# EAGLE design kit (EAGLE 9.0.1)

## Sheet 1 of 6
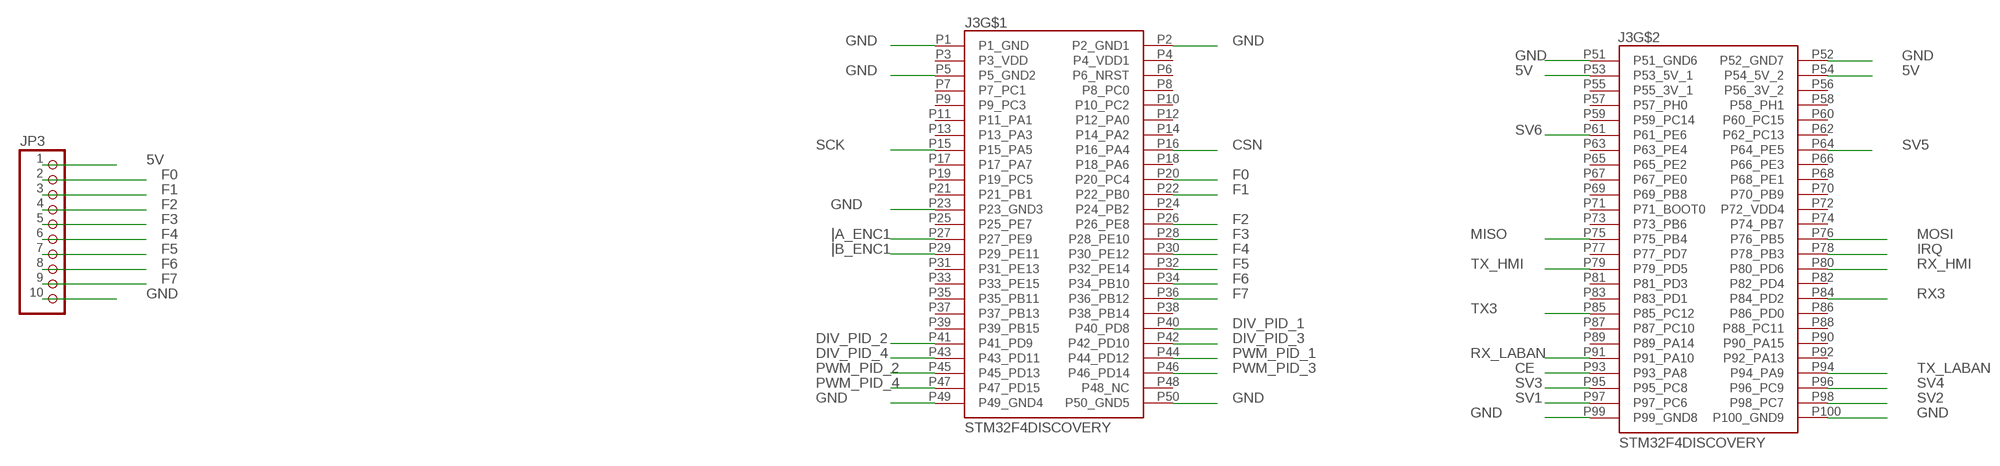
[diagram p0: schematic, sheet 1]

### Parts
J3  STM32F4DISCOVERY  [STMICROELECTRONICS_STM32F4DISCOVERY]
JP3  PINHD-1X10/90  [1X10/90]

### Nets
5V: J3.P53(P53_5V_1) J3.P54(P54_5V_2) JP3.1 ; also sheet 2,3,4,5,6
CE: J3.P93(P93_PA8) ; also sheet 5
CSN: J3.P16(P16_PA4) ; also sheet 5
DIV_PID_1: J3.P40(P40_PD8) ; also sheet 2
DIV_PID_2: J3.P41(P41_PD9) ; also sheet 2
DIV_PID_3: J3.P42(P42_PD10) ; also sheet 2
DIV_PID_4: J3.P43(P43_PD11) ; also sheet 2
F0: J3.P20(P20_PC4) JP3.2
F1: J3.P22(P22_PB0) JP3.3
F2: J3.P26(P26_PE8) JP3.4
F3: J3.P28(P28_PE10) JP3.5
F4: J3.P30(P30_PE12) JP3.6
F5: J3.P32(P32_PE14) JP3.7
F6: J3.P34(P34_PB10) JP3.8
F7: J3.P36(P36_PB12) JP3.9
GND: J3.P1(P1_GND) J3.P2(P2_GND1) J3.P5(P5_GND2) J3.P23(P23_GND3) J3.P49(P49_GND4) J3.P50(P50_GND5) J3.P51(P51_GND6) J3.P52(P52_GND7) J3.P99(P99_GND8) J3.P100(P100_GND9) JP3.10 ; also sheet 2,3,4,5,6
IRQ: J3.P78(P78_PB3) ; also sheet 5
MISO: J3.P75(P75_PB4) ; also sheet 5
MOSI: J3.P76(P76_PB5) ; also sheet 5
PWM_PID_1: J3.P44(P44_PD12) ; also sheet 2
PWM_PID_2: J3.P45(P45_PD13) ; also sheet 2
PWM_PID_3: J3.P46(P46_PD14) ; also sheet 2
PWM_PID_4: J3.P47(P47_PD15) ; also sheet 2
RX3: J3.P84(P84_PD2) ; also sheet 5
RX_HMI: J3.P80(P80_PD6)
RX_LABAN: J3.P91(P91_PA10) ; also sheet 5
SCK: J3.P15(P15_PA5) ; also sheet 5
SV1: J3.P97(P97_PC6) ; also sheet 3
SV2: J3.P98(P98_PC7) ; also sheet 3
SV3: J3.P95(P95_PC8) ; also sheet 3
SV4: J3.P96(P96_PC9) ; also sheet 3
SV5: J3.P64(P64_PE5)
SV6: J3.P61(P61_PE6)
TX3: J3.P85(P85_PC12) ; also sheet 5
TX_HMI: J3.P79(P79_PD5)
TX_LABAN: J3.P94(P94_PA9) ; also sheet 5
|A_ENC1: J3.P27(P27_PE9) ; also sheet 4
|B_ENC1: J3.P29(P29_PE11) ; also sheet 4
Unconnected: J3.P3(P3_VDD) J3.P4(P4_VDD1) J3.P6(P6_NRST) J3.P7(P7_PC1) J3.P8(P8_PC0) J3.P9(P9_PC3) J3.P10(P10_PC2) J3.P11(P11_PA1) J3.P12(P12_PA0) J3.P13(P13_PA3) J3.P14(P14_PA2) J3.P17(P17_PA7) J3.P18(P18_PA6) J3.P19(P19_PC5) J3.P21(P21_PB1) J3.P24(P24_PB2) J3.P25(P25_PE7) J3.P31(P31_PE13) J3.P33(P33_PE15) J3.P35(P35_PB11) J3.P37(P37_PB13) J3.P38(P38_PB14) J3.P39(P39_PB15) J3.P48(P48_NC) J3.P55(P55_3V_1) J3.P56(P56_3V_2) J3.P57(P57_PH0) J3.P58(P58_PH1) J3.P59(P59_PC14) J3.P60(P60_PC15) J3.P62(P62_PC13) J3.P63(P63_PE4) J3.P65(P65_PE2) J3.P66(P66_PE3) J3.P67(P67_PE0) J3.P68(P68_PE1) J3.P69(P69_PB8) J3.P70(P70_PB9) J3.P71(P71_BOOT0) J3.P72(P72_VDD4) J3.P73(P73_PB6) J3.P74(P74_PB7) J3.P77(P77_PD7) J3.P81(P81_PD3) J3.P82(P82_PD4) J3.P83(P83_PD1) J3.P86(P86_PD0) J3.P87(P87_PC10) J3.P88(P88_PC11) J3.P89(P89_PA14) J3.P90(P90_PA15) J3.P92(P92_PA13)

## Sheet 2 of 6
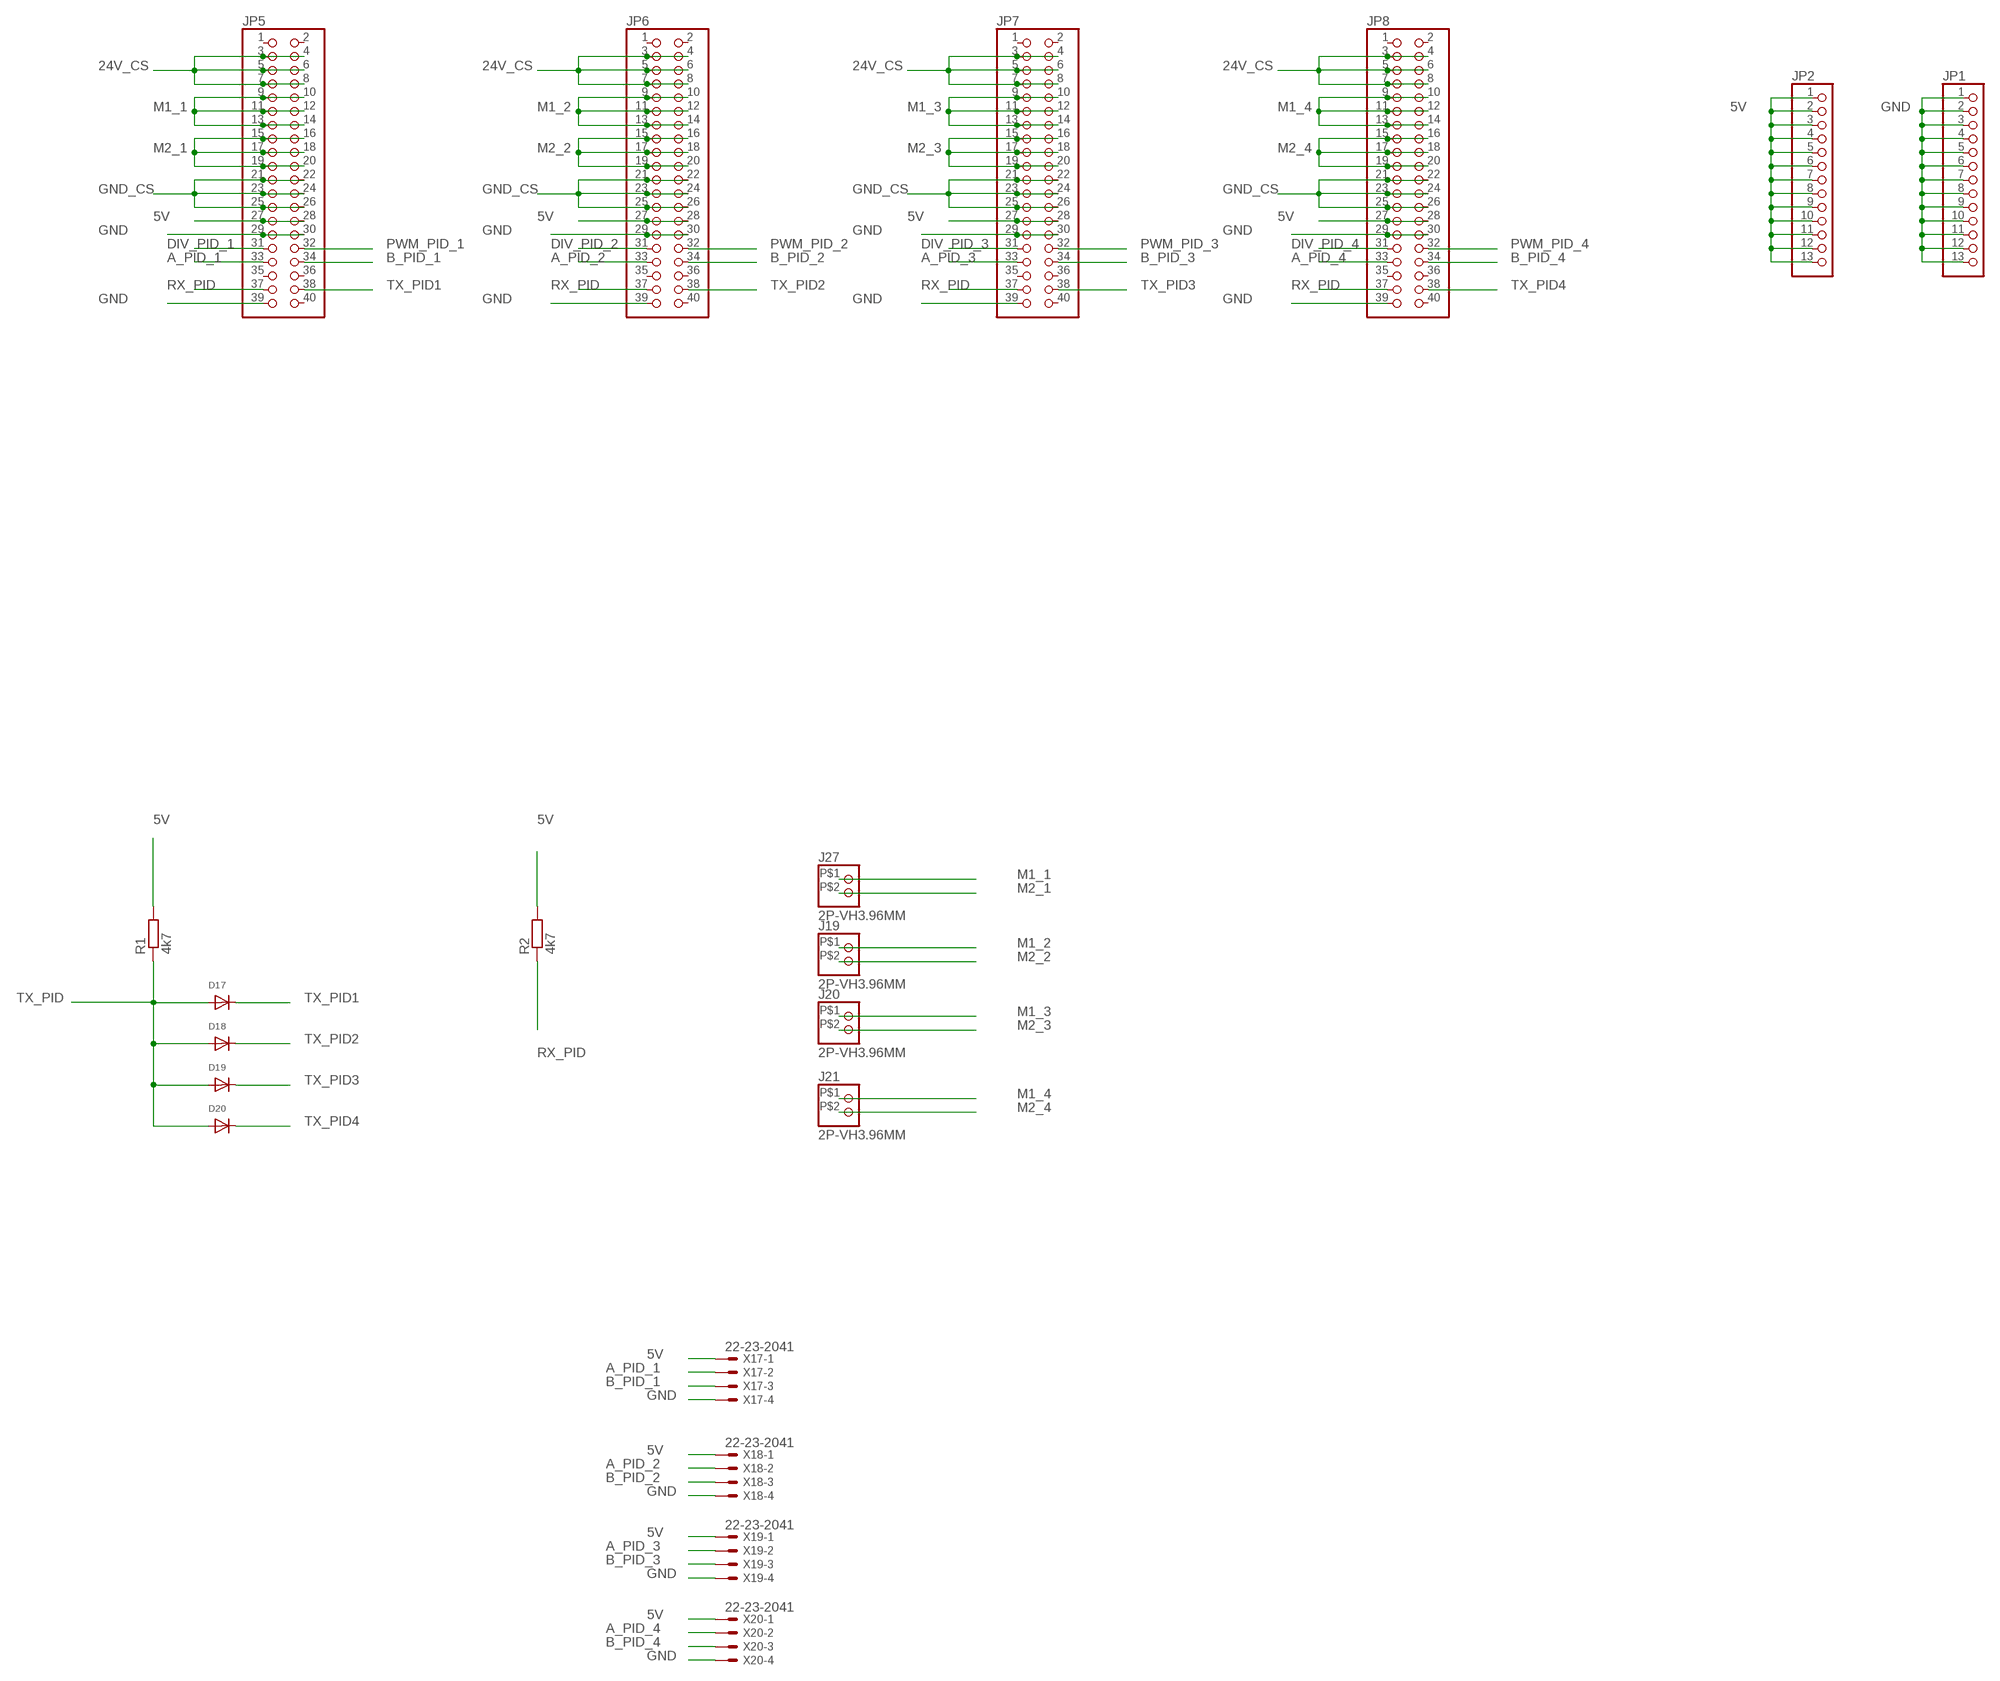
[diagram p1: schematic, sheet 2]

### Parts
D17  DIODEDO-1N4148  [DO-1N4148]
D18  DIODEDO-1N4148  [DO-1N4148]
D19  DIODEDO-1N4148  [DO-1N4148]
D20  DIODEDO-1N4148  [DO-1N4148]
J19  2P-VH3.96MM  [2P-VH3.96MM]
J20  2P-VH3.96MM  [2P-VH3.96MM]
J21  2P-VH3.96MM  [2P-VH3.96MM]
J27  2P-VH3.96MM  [2P-VH3.96MM]
JP1  PINHD-1X13  [1X13]
JP2  PINHD-1X13  [1X13]
JP5  PINHD-2X20  [2X20]
JP6  PINHD-2X20  [2X20]
JP7  PINHD-2X20  [2X20]
JP8  PINHD-2X20  [2X20]
R1  4k7  R-EU_0207/10  [0207/10]
R2  4k7  R-EU_0207/10  [0207/10]
X17  22-23-2041  [22-23-2041]
X18  22-23-2041  [22-23-2041]
X19  22-23-2041  [22-23-2041]
X20  22-23-2041  [22-23-2041]

### Nets
5V: JP2.1 JP2.2 JP2.3 JP2.4 JP2.5 JP2.6 JP2.7 JP2.8 JP2.9 JP2.10 JP2.11 JP2.12 JP2.13 JP5.27 JP5.28 JP6.27 JP6.28 JP7.27 JP7.28 JP8.27 JP8.28 R1.2 R2.2 X17.1 X18.1 X19.1 X20.1 ; also sheet 1,3,4,5,6
24V_CS: JP5.3 JP5.4 JP5.5 JP5.6 JP5.7 JP5.8 JP6.3 JP6.4 JP6.5 JP6.6 JP6.7 JP6.8 JP7.3 JP7.4 JP7.5 JP7.6 JP7.7 JP7.8 JP8.3 JP8.4 JP8.5 JP8.6 JP8.7 JP8.8 ; also sheet 6
A_PID_1: JP5.33 X17.2
A_PID_2: JP6.33 X18.2
A_PID_3: JP7.33 X19.2
A_PID_4: JP8.33 X20.2
B_PID_1: JP5.34 X17.3
B_PID_2: JP6.34 X18.3
B_PID_3: JP7.34 X19.3
B_PID_4: JP8.34 X20.3
DIV_PID_1: JP5.31 ; also sheet 1
DIV_PID_2: JP6.31 ; also sheet 1
DIV_PID_3: JP7.31 ; also sheet 1
DIV_PID_4: JP8.31 ; also sheet 1
GND: JP1.1 JP1.2 JP1.3 JP1.4 JP1.5 JP1.6 JP1.7 JP1.8 JP1.9 JP1.10 JP1.11 JP1.12 JP1.13 JP5.29 JP5.30 JP5.39 JP6.29 JP6.30 JP6.39 JP7.29 JP7.30 JP7.39 JP8.29 JP8.30 JP8.39 X17.4 X18.4 X19.4 X20.4 ; also sheet 1,3,4,5,6
GND_CS: JP5.21 JP5.22 JP5.23 JP5.24 JP5.25 JP5.26 JP6.21 JP6.22 JP6.23 JP6.24 JP6.25 JP6.26 JP7.21 JP7.22 JP7.23 JP7.24 JP7.25 JP7.26 JP8.21 JP8.22 JP8.23 JP8.24 JP8.25 JP8.26 ; also sheet 6
M1_1: J27.P$1 JP5.9 JP5.10 JP5.11 JP5.12 JP5.13 JP5.14
M1_2: J19.P$1 JP6.9 JP6.10 JP6.11 JP6.12 JP6.13 JP6.14
M1_3: J20.P$1 JP7.9 JP7.10 JP7.11 JP7.12 JP7.13 JP7.14
M1_4: J21.P$1 JP8.9 JP8.10 JP8.11 JP8.12 JP8.13 JP8.14
M2_1: J27.P$2 JP5.15 JP5.16 JP5.17 JP5.18 JP5.19 JP5.20
M2_2: J19.P$2 JP6.15 JP6.16 JP6.17 JP6.18 JP6.19 JP6.20
M2_3: J20.P$2 JP7.15 JP7.16 JP7.17 JP7.18 JP7.19 JP7.20
M2_4: J21.P$2 JP8.15 JP8.16 JP8.17 JP8.18 JP8.19 JP8.20
PWM_PID_1: JP5.32 ; also sheet 1
PWM_PID_2: JP6.32 ; also sheet 1
PWM_PID_3: JP7.32 ; also sheet 1
PWM_PID_4: JP8.32 ; also sheet 1
RX_PID: JP5.37 JP6.37 JP7.37 JP8.37 R2.1 ; also sheet 5
TX_PID: D17.A D18.A D19.A D20.A R1.1 ; also sheet 5
TX_PID1: D17.C JP5.38
TX_PID2: D18.C JP6.38
TX_PID3: D19.C JP7.38
TX_PID4: D20.C JP8.38
Unconnected: JP5.1 JP5.2 JP5.35 JP5.36 JP5.40 JP6.1 JP6.2 JP6.35 JP6.36 JP6.40 JP7.1 JP7.2 JP7.35 JP7.36 JP7.40 JP8.1 JP8.2 JP8.35 JP8.36 JP8.40

## Sheet 3 of 6
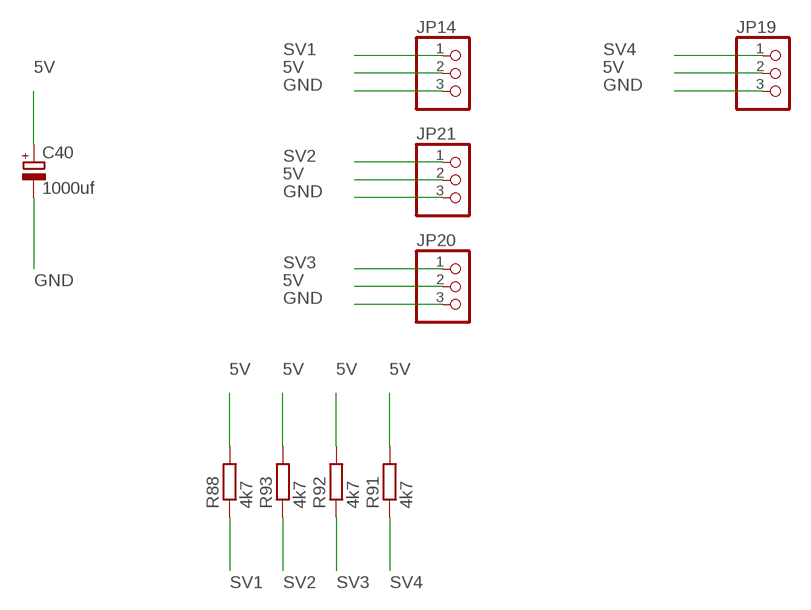
[diagram p2: schematic, sheet 3]

### Parts
C40  1000uf  CPOL-EUE5-10.5  [E5-10,5]
JP14  PINHD-1X3  [1X03]
JP19  PINHD-1X3  [1X03]
JP20  PINHD-1X3  [1X03]
JP21  PINHD-1X3  [1X03]
R88  4k7  R-EU_0207/10  [0207/10]
R91  4k7  R-EU_0207/10  [0207/10]
R92  4k7  R-EU_0207/10  [0207/10]
R93  4k7  R-EU_0207/10  [0207/10]

### Nets
5V: C40.+ JP14.2 JP19.2 JP20.2 JP21.2 R88.2 R91.2 R92.2 R93.2 ; also sheet 1,2,4,5,6
GND: C40.- JP14.3 JP19.3 JP20.3 JP21.3 ; also sheet 1,2,4,5,6
SV1: JP14.1 R88.1 ; also sheet 1
SV2: JP21.1 R93.1 ; also sheet 1
SV3: JP20.1 R92.1 ; also sheet 1
SV4: JP19.1 R91.1 ; also sheet 1

## Sheet 4 of 6
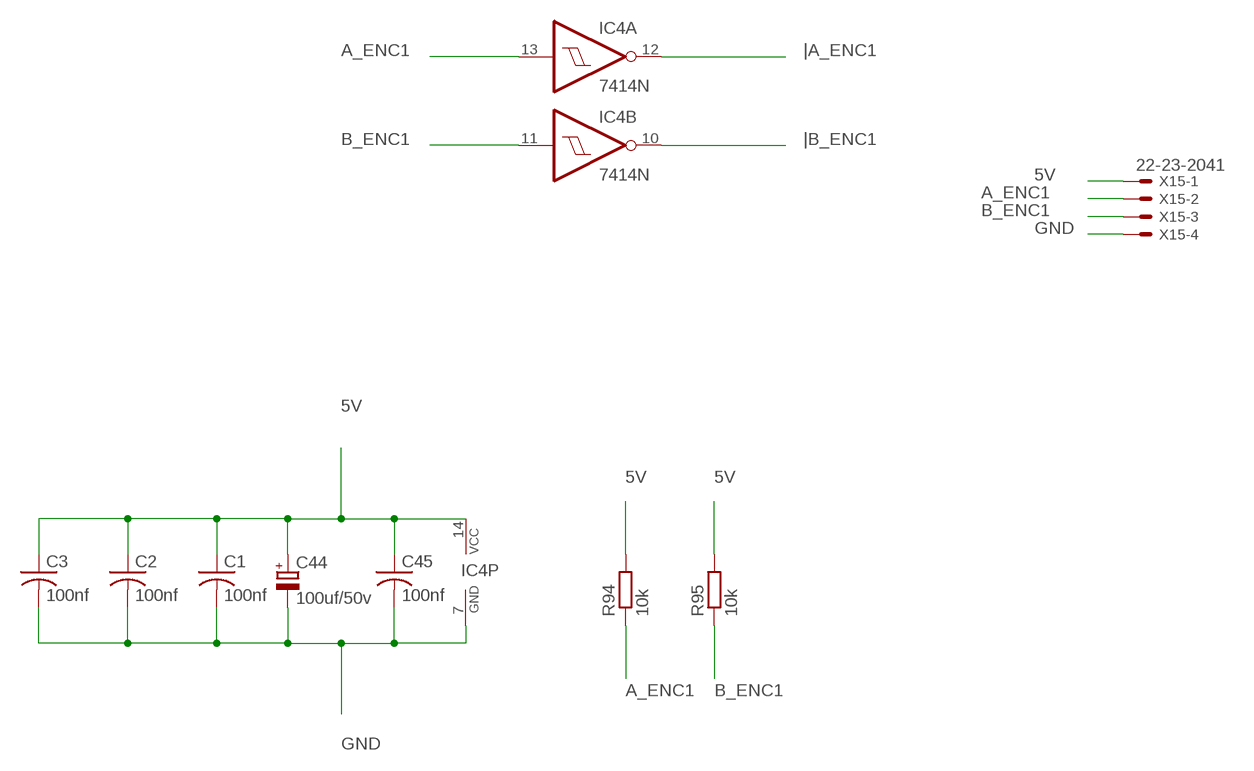
[diagram p3: schematic, sheet 4]

### Parts
C1  100nf  C-US050-025X075  [C050-025X075]
C2  100nf  C-US050-025X075  [C050-025X075]
C3  100nf  C-US050-025X075  [C050-025X075]
C44  100uf/50v  CPOL-EUE5-10.5  [E5-10,5]
C45  100nf  C-US050-025X075  [C050-025X075]
IC4  7414N  [DIL14]
R94  10k  R-EU_0207/10  [0207/10]
R95  10k  R-EU_0207/10  [0207/10]
X15  22-23-2041  [22-23-2041]

### Nets
5V: C1.1 C2.1 C3.1 C44.+ C45.1 IC4.14(P:VCC) R94.2 R95.2 X15.1 ; also sheet 1,2,3,5,6
A_ENC1: IC4.13(A:I) R94.1 X15.2
B_ENC1: IC4.11(B:I) R95.1 X15.3
GND: C1.2 C2.2 C3.2 C44.- C45.2 IC4.7(P:GND) X15.4 ; also sheet 1,2,3,5,6
|A_ENC1: IC4.12(A:O) ; also sheet 1
|B_ENC1: IC4.10(B:O) ; also sheet 1
Unconnected: IC4.1(D:I) IC4.2(D:O) IC4.3(E:I) IC4.4(E:O) IC4.5(F:I) IC4.6(F:O) IC4.8(C:O) IC4.9(C:I)

## Sheet 5 of 6
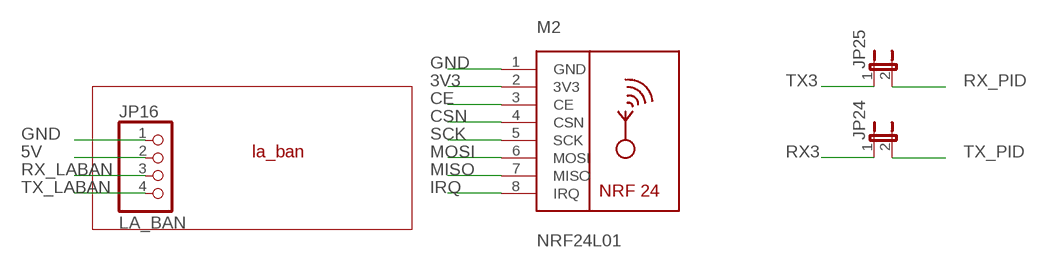
[diagram p4: schematic, sheet 5]

### Parts
JP16  LA_BAN  PINHD-1X4  [1X04]
JP24  JP1E  [JP1]
JP25  JP1E  [JP1]
M2  NRF24L01  [NRF24L01_CHANCAM_ANTEN_ONBOARD]

### Nets
3V3: M2.2(3V3) ; also sheet 6
5V: JP16.2 ; also sheet 1,2,3,4,6
CE: M2.3(CE) ; also sheet 1
CSN: M2.4(CSN) ; also sheet 1
GND: JP16.1 M2.1(GND) ; also sheet 1,2,3,4,6
IRQ: M2.8(IRQ) ; also sheet 1
MISO: M2.7(MISO) ; also sheet 1
MOSI: M2.6(MOSI) ; also sheet 1
RX3: JP24.1 ; also sheet 1
RX_LABAN: JP16.3 ; also sheet 1
RX_PID: JP25.2 ; also sheet 2
SCK: M2.5(SCK) ; also sheet 1
TX3: JP25.1 ; also sheet 1
TX_LABAN: JP16.4 ; also sheet 1
TX_PID: JP24.2 ; also sheet 2

### Notes on the sheet
- la_ban

## Sheet 6 of 6
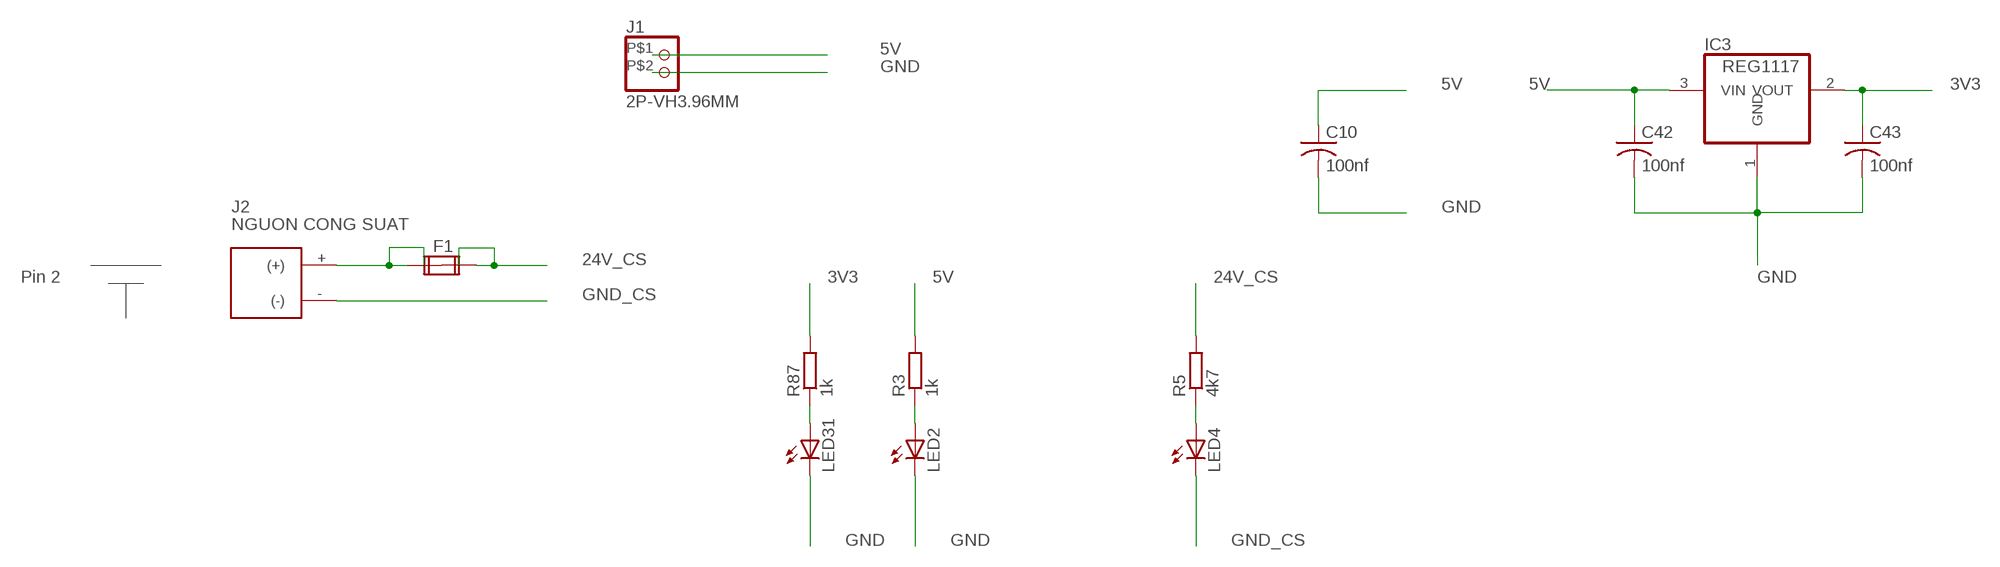
[diagram p5: schematic, sheet 6]

### Parts
C10  100nf  C-US050-025X075  [C050-025X075]
C42  100nf  C-US050-025X075  [C050-025X075]
C43  100nf  C-US050-025X075  [C050-025X075]
F1  FUSE2P  [FUSE1]
IC3  REG1117  [SOT223]
J1  2P-VH3.96MM  [2P-VH3.96MM]
J2  NGUON CONG SUAT  JACK-DC  [XT-60]
LED2  LED3MM  [LED3MM]
LED4  LED3MM  [LED3MM]
LED31  LED3MM  [LED3MM]
R3  1k  R-EU_0207/10  [0207/10]
R5  4k7  R-EU_0207/10  [0207/10]
R87  1k  R-EU_0207/10  [0207/10]

### Nets
3V3: C43.1 IC3.2(VOUT) R87.2 ; also sheet 5
5V: C10.1 C42.1 IC3.3(VIN) J1.P$1 R3.2 ; also sheet 1,2,3,4,5
24V_CS: F1.2A F1.2B R5.2 ; also sheet 2
GND: C10.2 C42.2 C43.2 IC3.1(GND) J1.P$2 LED2.K(C) LED31.K(C) ; also sheet 1,2,3,4,5
GND_CS: J2.-((-)) LED4.K(C) ; also sheet 2
N$5: LED2.A R3.1
N$7: LED4.A R5.1
N$124: F1.1A F1.1B J2.+((+))
N$127: LED31.A R87.1

### Notes on the sheet
- Pin 2

## Library data of the parts
C1-C3 C10 C42 C43 C45 = adafruit:C-US: CAPACITOR, American symbol
C40 C44 = rcl:CPOL-EU: POLARIZED CAPACITOR, European symbol; SPICEPREFIX: C
D17-D20 = adafruit:DIODE: Diode SMADIODE - SMA Surface Mount Package 20V 1A Schottky Diode Digikey: 641-1014-6-ND DO-1N4148 - Through Hole Small Current Diode SOD-123 20V 1 A (.5mV Vf) Schottky Diode - Digikey: MBRX120TPMSCT-ND SOD-323 10V 570mA (.38mV Vf, 3ns) Schottky Diode - Digikey: ZLLS410CT-ND SOD-523 30V 30mA Schottky Diode (RB751S-40TE61) - Digikey: RB751S-40TE61CT-ND SOT23-R/W - SOT23 Package (R = Solder Paste/Reflow Ovens, W = Hand-Soldering) BAT54Film 40V 300mA - Digikey: 497-7162-1-ND
F1 = special:FUSE2P: FUSE 5 x 20 mm
IC3 = burr-brown:REG1117: 800mA and 1A Low Dropout (LDO) Positive Regulator 1.8V, 2.5V, 2.85V, 3.3V, 5V, and Adj; MPN: REG1117; OC_FARNELL: 1097566; OC_NEWARK: 14P6981
IC4 = 74xx-eu:74*14: Hex schmitt trigger INVERTER
J1 J19-J21 J27 = minh:2P-VH3.96MM
J2 = minh:JACK-DC
J3 = STM32F4DISCOVERY:STM32F4DISCOVERY: EVAL KIT STM32F DISCOVERY; AVAILABILITY: Unavailable; DESCRIPTION: Development kit: ARM ST; pin strips, pin header; No.of; MF: STMicroelectronics; MP: STM32F4DISCOVERY; PACKAGE: None; PRICE: None
JP1 JP2 = pinhead:PINHD-1X13: PIN HEADER
JP3 = pinhead:PINHD-1X10: PIN HEADER
JP5-JP8 = minh:PINHD-2X20: PIN HEADER
JP14 JP19-JP21 = pinhead:PINHD-1X3: PIN HEADER
JP16 = pinhead:PINHD-1X4: PIN HEADER
JP24 JP25 = jumper:JP1E: JUMPER
LED2 LED4 LED31 = adafruit:LED: LED OSRAM: - CHIPLED LG R971, LG N971, LY N971, LG Q971, LY Q971, LO R971, LY R971 LH N974, LH R974 LS Q976, LO Q976, LY Q976 LO Q996 - Hyper CHIPLED LW Q18S LB Q993, LB Q99A, LB R99A - SideLED LS A670, LO A670, LY A670, LG A670, LP A670 LB A673, LV A673, LT A673, LW A673 LH A674 LY A675 LS A676, LA A676, LO A676, LY A676, LW A676 LS A679, LY A679, LG A679 - Hyper Micro SIDELED® LS Y876, LA Y876, LO Y876, LY Y876 LT Y87S - SmartLED LW L88C, LW L88S LB L89C, LB L89S, LG L890 LS L89K, LO L89K, LY L89K LS L896, LA L896, LO L896, LY L896 - TOPLED LS T670, LO T670, LY T670, LG T670, LP T670 LSG T670, LSP T670, LSY T670, LOP T670, LYG T670 LG T671, LOG T671, LSG T671 LB T673, LV T673, LT T673, LW T673 LH T674 LS T676, LA T676, LO T676, LY T676, LB T676, LH T676, LSB T676, LW T676 LB T67C, LV T67C, LT T67C, LS T67K, LO T67K, LY T67K, LW E67C LS E67B, LA E67B, LO E67B, LY E67B, LB E67C, LV E67C, LT E67C LW T67C LS T679, LY T679, LG T679 LS T770, LO T770, LY T770, LG T770, LP T770 LB T773, LV T773, LT T773, LW T773 LH T774 LS E675, LA E675, LY E675, LS T675 LS T776, LA T776, LO T776, LY T776, LB T776 LHGB T686 LT T68C, LB T68C - Hyper Mini TOPLED® LB M676 - Mini TOPLED Santana® LG M470 LS M47K, LO M47K, LY M47K Source: http://www.osram.convergy.de/
M2 = minh:NRF24L01
R1-R3 R5 R87 R88 R91-R95 = rcl:R-EU_: RESISTOR, European symbol; SPICEPREFIX: R
X15 X17-X20 = con-molex:22-23-2041: .100" (2.54mm) Center Header - 4 Pin; MF: MOLEX; MPN: 22-23-2041; OC_FARNELL: 1462920; OC_NEWARK: 38C0355

## Board
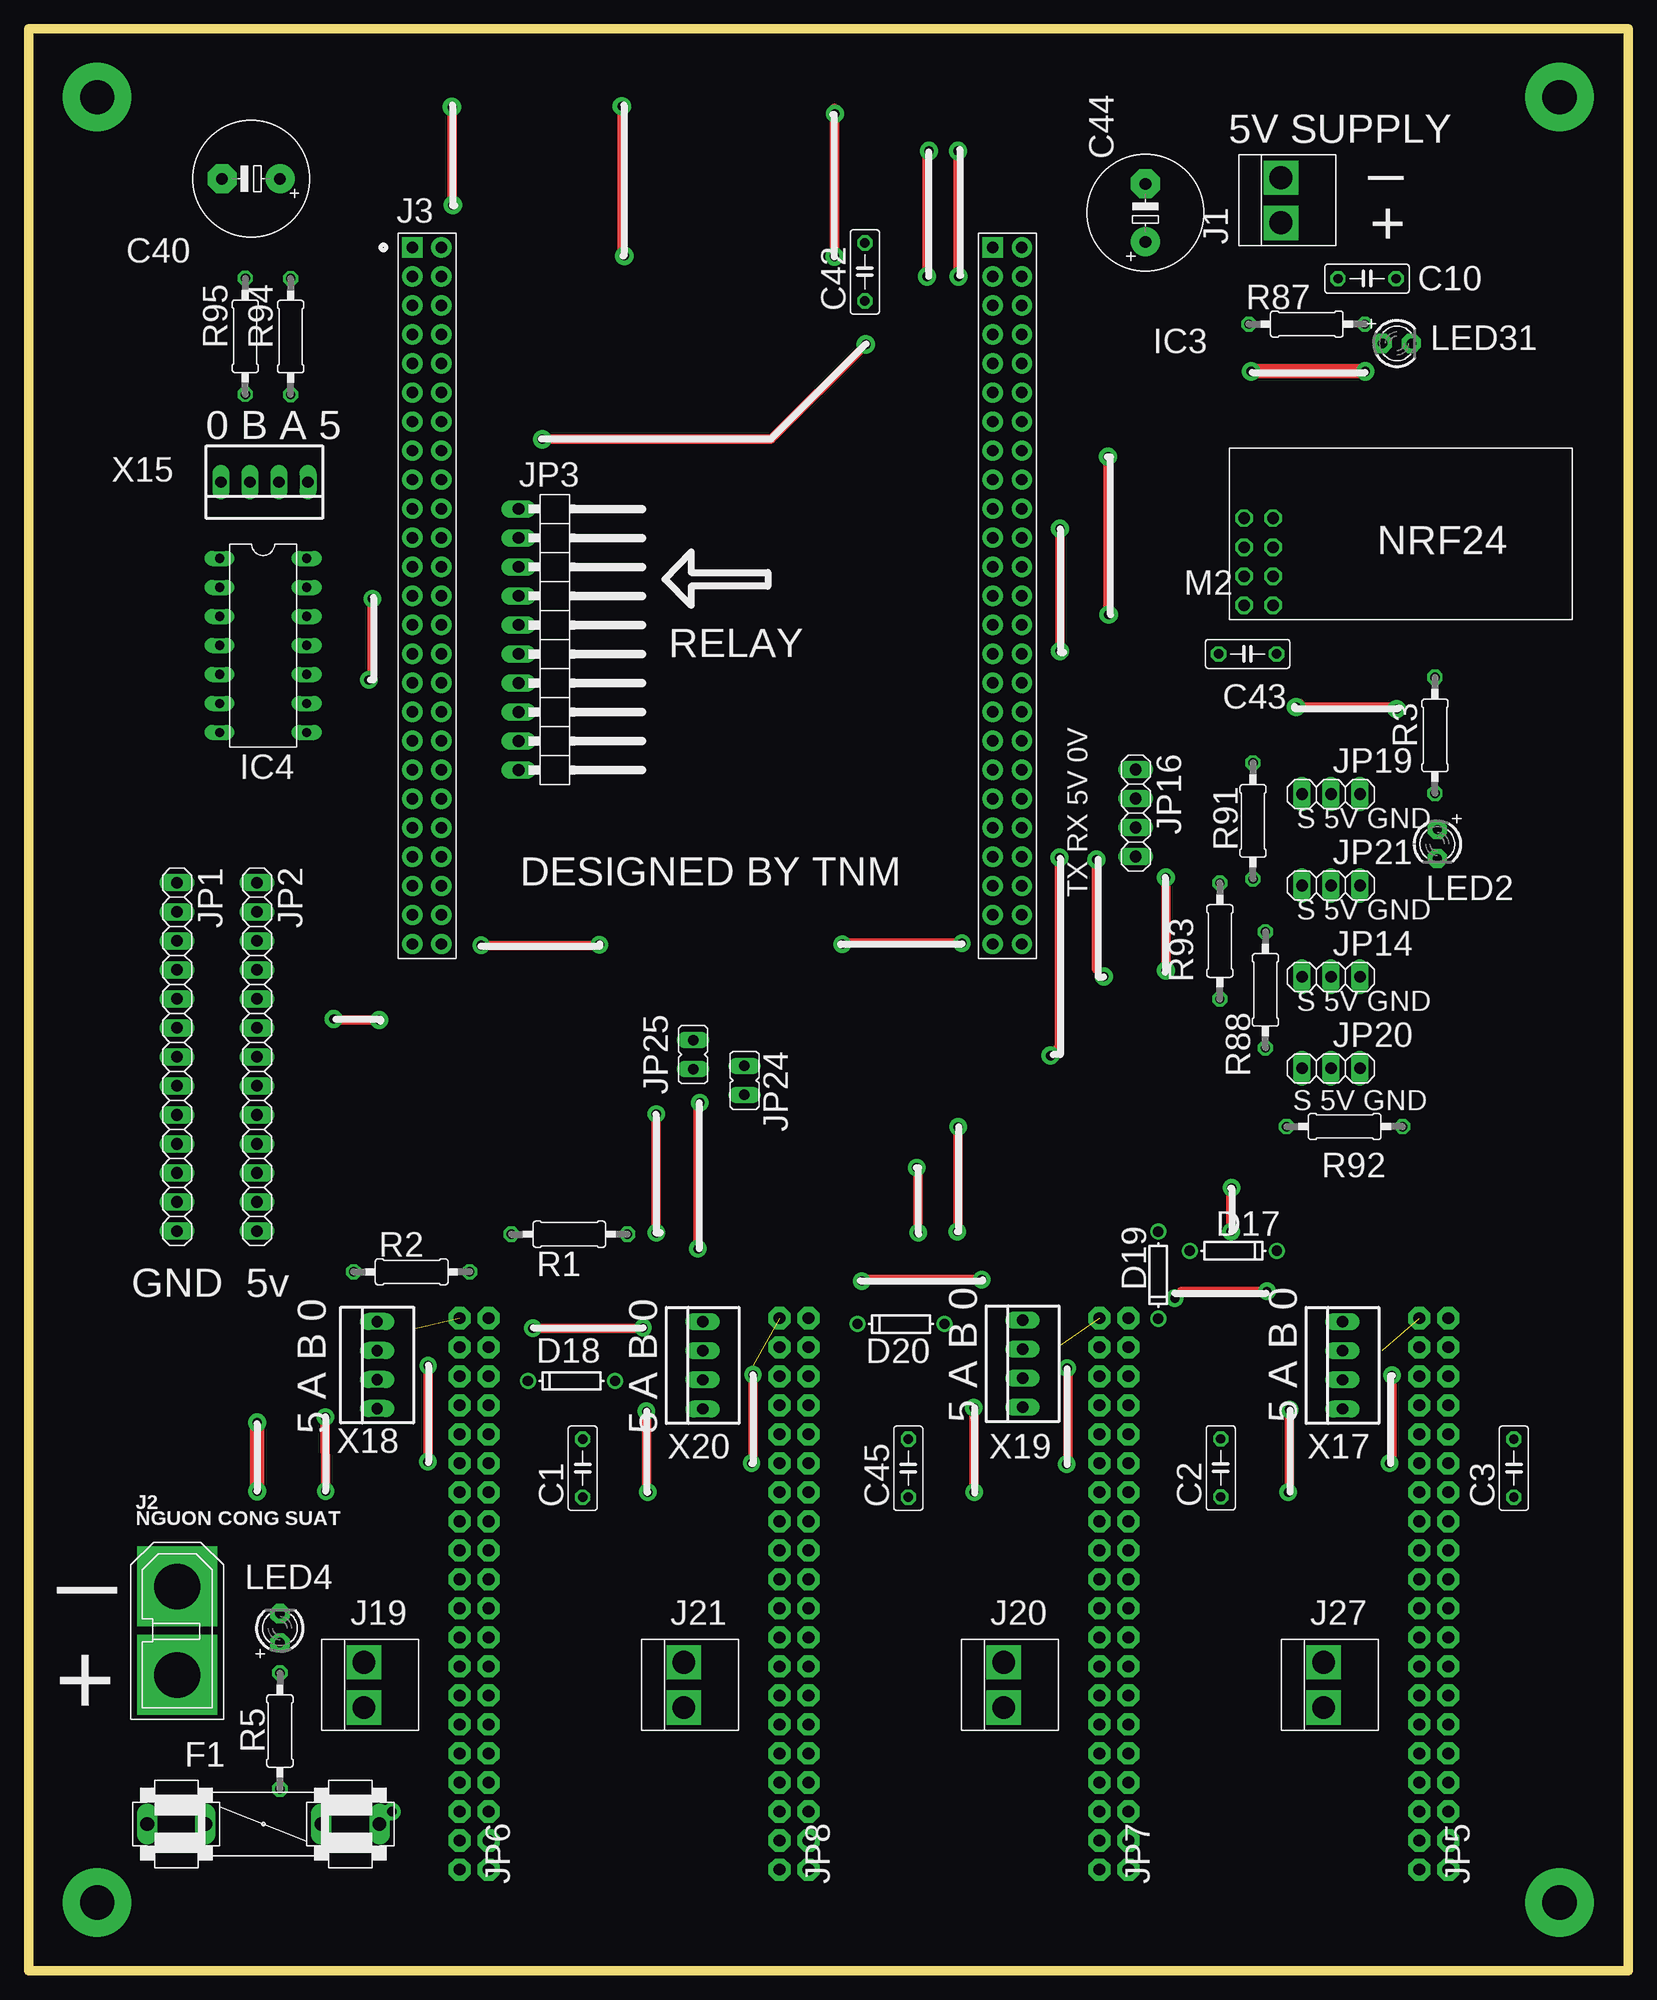
[diagram p6: board, top side]
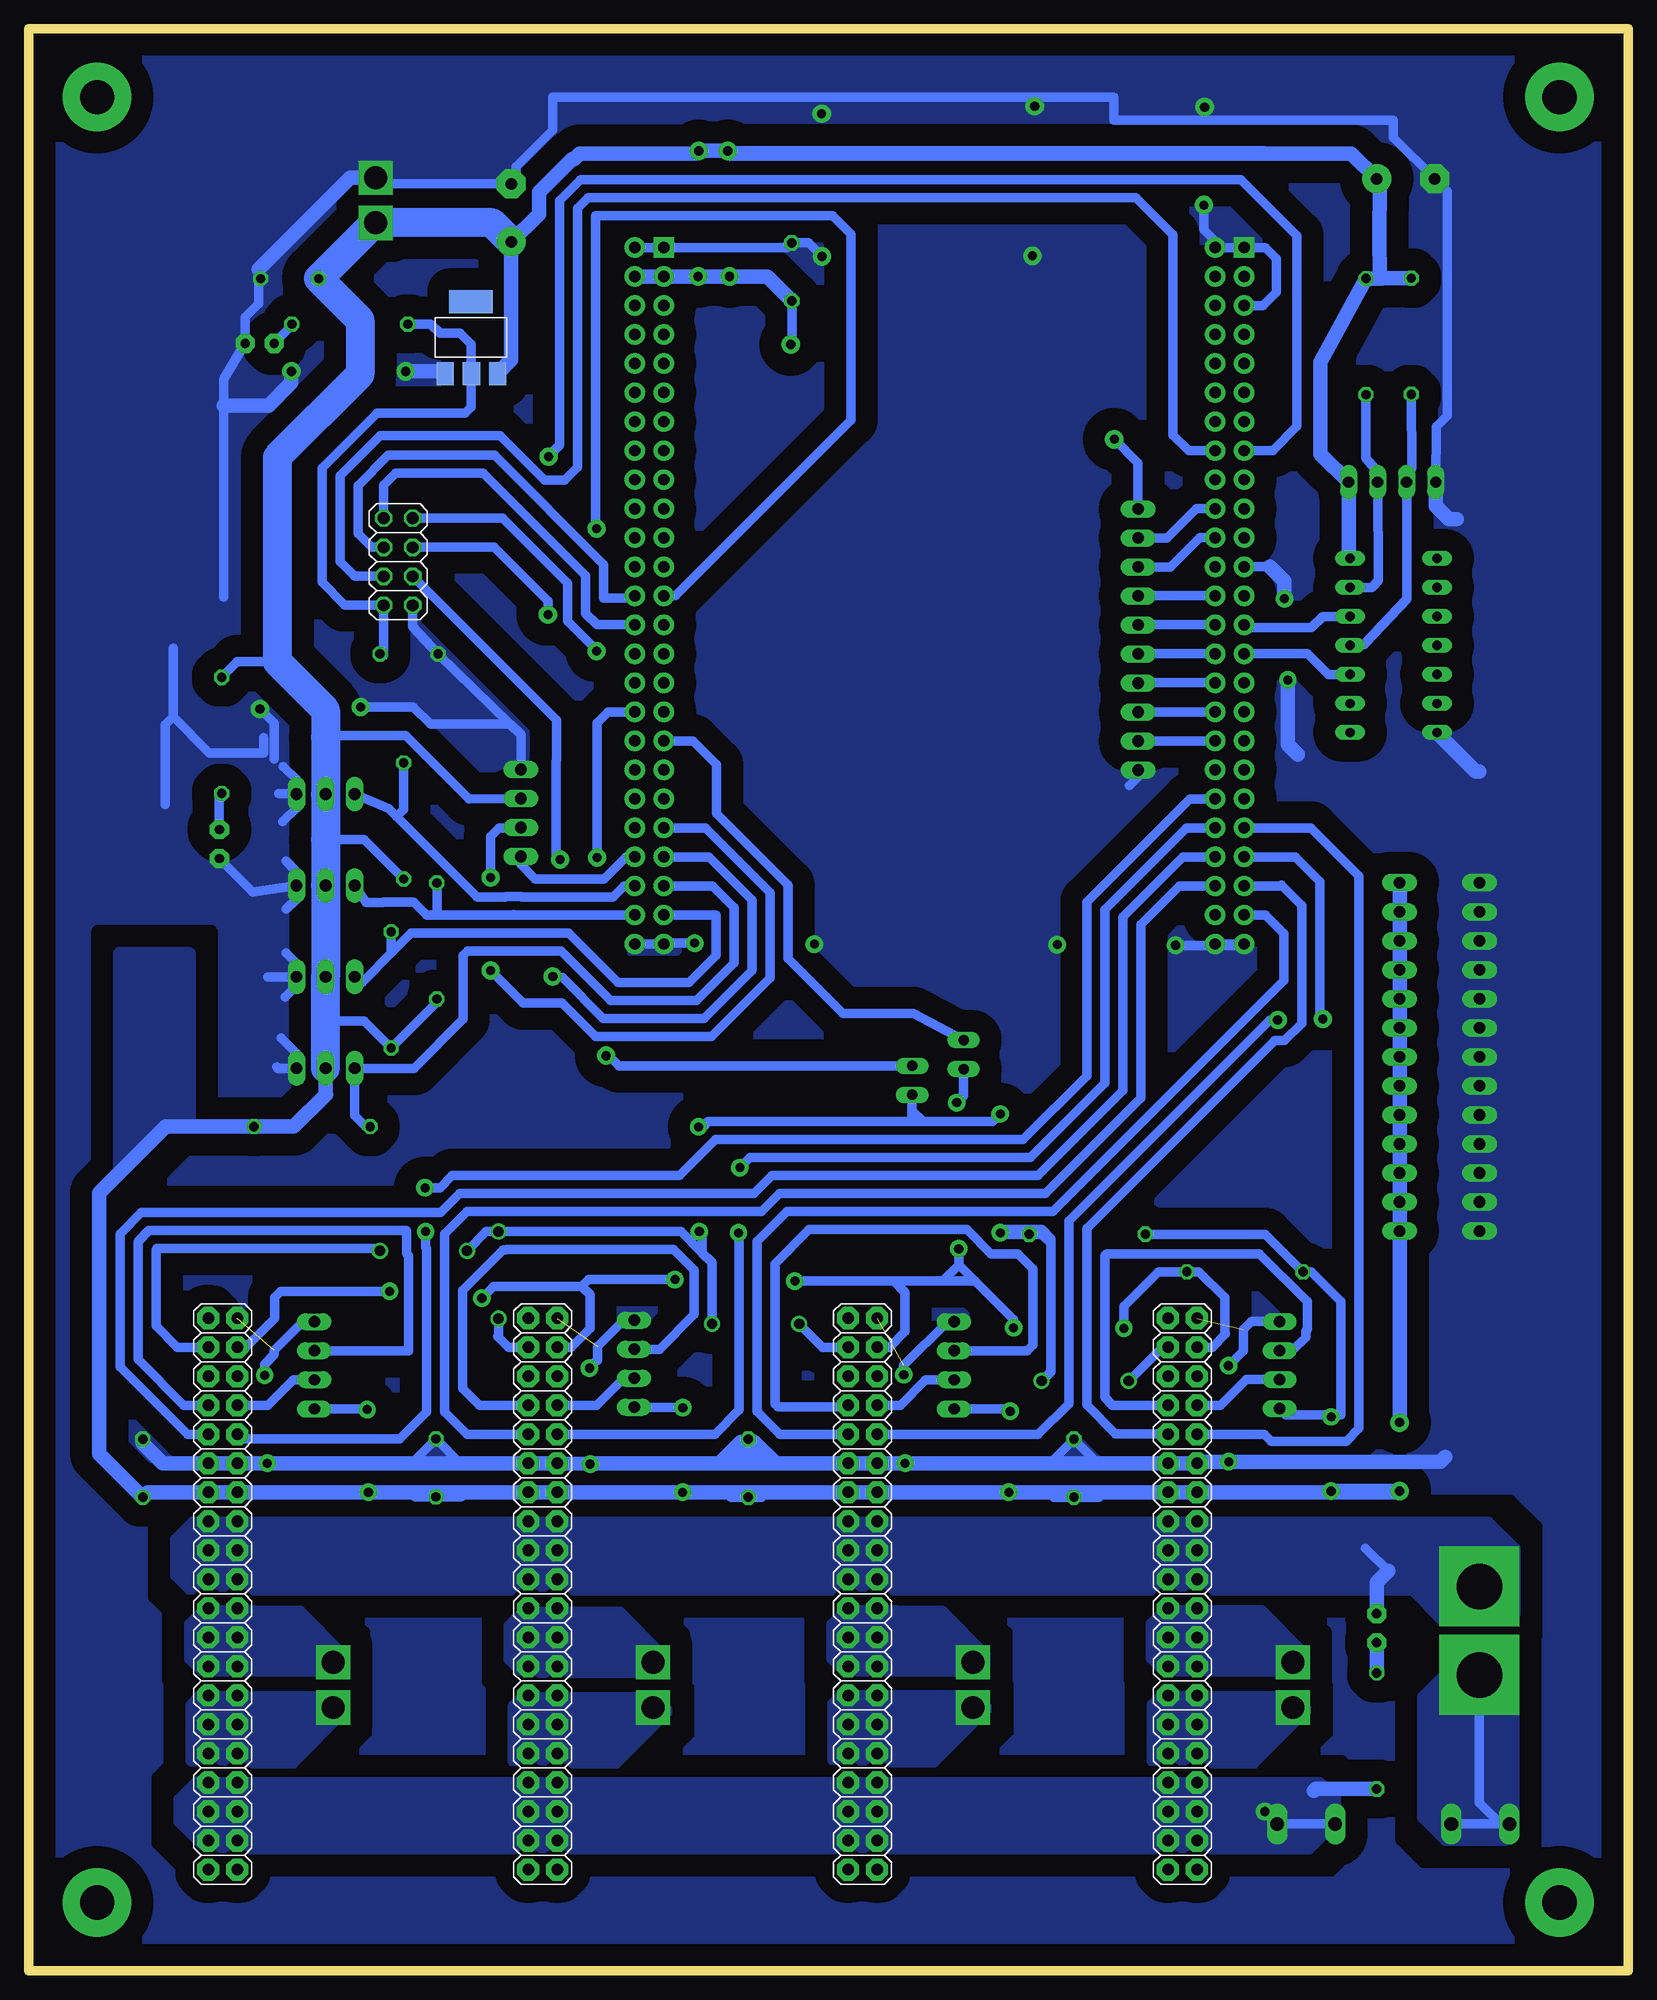
[diagram p7: board, bottom side, seen from below]

Size 140 x 170 mm. Coordinates in mm from the lower left corner, seen from the top.
Outline: 0,0 0,170 140,170 140,0 0,0
Copper layers (1*16): Top 0.035mm / dielectric 1.5mm / Bottom 0.035mm
Design rules "default *": minimum track width 30mil, minimum drill 0.8mm, track to track 30mil, track to pad 20mil, pad to pad 20mil, via to via 20mil, smd to smd 6mil, copper to edge 40mil, drill to drill 6mil, minimum pad ring 10mil, minimum via ring 8mil, stop-mask expansion 4mil, vias tented up to drill 0mil, thermal gap 10mil

### Footprints (pad centres in the part's own frame; a part is rotated, then mirrored left to right if it is on the bottom)
C050-025X075 = drill 0.813 octagon: 1 -2.54,0; 2 2.54,0
E5-10,5 = drill 1.016 pad 2.54: + -2.54,0 | drill 1.016 pad 2.54 octagon: - 2.54,0
DO-1N4148 = drill 0.9: A -3.81,0; C 3.81,0
FUSE1 = drill 1.194 long: 1A -10.16,0; 1B -5.08,0; 2A 10.16,0; 2B 5.08,0
SOT223 = smd 1.499 x 2.007: 1 -2.261,-3.15; 2 0.025,-3.15; 3 2.311,-3.15 | smd 3.81 x 2.007: 4 0,3.15
DIL14 = drill 0.813 long: 1 -7.62,-3.81; 2 -5.08,-3.81; 3 -2.54,-3.81; 4 0,-3.81; 5 2.54,-3.81; 6 5.08,-3.81; 7 7.62,-3.81; 8 7.62,3.81; 9 5.08,3.81; 10 2.54,3.81; 11 0,3.81; 12 -2.54,3.81; 13 -5.08,3.81; 14 -7.62,3.81
2P-VH3.96MM = drill 2 square: P$1 -1.956,1.651; P$2 2.004,1.651
XT-60 = drill 4 pad 7 square: + 0.24,-3.745; - 0.24,4.005
STMICROELECTRONICS_STM32F4DISCOVERY = drill 1 pad 1.778 square: P1 0,0; P51 50.8,0 | drill 1 pad 1.778: P2 2.54,0; P3 0,-2.54; P4 2.54,-2.54; P5 0,-5.08; P6 2.54,-5.08; P7 0,-7.62; P8 2.54,-7.62; P9 0,-10.16; P10 2.54,-10.16; P11 0,-12.7; P12 2.54,-12.7; P13 0,-15.24; P14 2.54,-15.24; P15 0,-17.78; P16 2.54,-17.78; P17 0,-20.32; P18 2.54,-20.32; P19 0,-22.86; P20 2.54,-22.86; P21 0,-25.4; P22 2.54,-25.4; P23 0,-27.94; P24 2.54,-27.94; P25 0,-30.48; P26 2.54,-30.48; P27 0,-33.02; P28 2.54,-33.02; P29 0,-35.56; P30 2.54,-35.56; P31 0,-38.1; P32 2.54,-38.1; P33 0,-40.64; P34 2.54,-40.64; P35 0,-43.18; P36 2.54,-43.18; P37 0,-45.72; P38 2.54,-45.72; P39 0,-48.26; P40 2.54,-48.26; P41 0,-50.8; P42 2.54,-50.8; P43 0,-53.34; P44 2.54,-53.34; P45 0,-55.88; P46 2.54,-55.88; P47 0,-58.42; P48 2.54,-58.42; P49 0,-60.96; P50 2.54,-60.96; P52 53.34,0; P53 50.8,-2.54; P54 53.34,-2.54; P55 50.8,-5.08; P56 53.34,-5.08; P57 50.8,-7.62; P58 53.34,-7.62; P59 50.8,-10.16; P60 53.34,-10.16; P61 50.8,-12.7; P62 53.34,-12.7; P63 50.8,-15.24; P64 53.34,-15.24; P65 50.8,-17.78; P66 53.34,-17.78; P67 50.8,-20.32; P68 53.34,-20.32; P69 50.8,-22.86; P70 53.34,-22.86; P71 50.8,-25.4; P72 53.34,-25.4; P73 50.8,-27.94; P74 53.34,-27.94; P75 50.8,-30.48; P76 53.34,-30.48; P77 50.8,-33.02; P78 53.34,-33.02; P79 50.8,-35.56; P80 53.34,-35.56; P81 50.8,-38.1; P82 53.34,-38.1; P83 50.8,-40.64; P84 53.34,-40.64; P85 50.8,-43.18; P86 53.34,-43.18; P87 50.8,-45.72; P88 53.34,-45.72; P89 50.8,-48.26; P90 53.34,-48.26; P91 50.8,-50.8; P92 53.34,-50.8; P93 50.8,-53.34; P94 53.34,-53.34; P95 50.8,-55.88; P96 53.34,-55.88; P97 50.8,-58.42; P98 53.34,-58.42; P99 50.8,-60.96; P100 53.34,-60.96
1X13 = drill 1.016 long: 1 -15.24,0; 2 -12.7,0; 3 -10.16,0; 4 -7.62,0; 5 -5.08,0; 6 -2.54,0; 7 0,0; 8 2.54,0; 9 5.08,0; 10 7.62,0; 11 10.16,0; 12 12.7,0; 13 15.24,0
1X10/90 = drill 1.016 long: 1 -11.43,-3.81; 2 -8.89,-3.81; 3 -6.35,-3.81; 4 -3.81,-3.81; 5 -1.27,-3.81; 6 1.27,-3.81; 7 3.81,-3.81; 8 6.35,-3.81; 9 8.89,-3.81; 10 11.43,-3.81
2X20 = drill 1.016 pad 1.93 octagon: 1 -24.13,-1.27; 2 -24.13,1.27; 3 -21.59,-1.27; 4 -21.59,1.27; 5 -19.05,-1.27; 6 -19.05,1.27; 7 -16.51,-1.27; 8 -16.51,1.27; 9 -13.97,-1.27; 10 -13.97,1.27; 11 -11.43,-1.27; 12 -11.43,1.27; 13 -8.89,-1.27; 14 -8.89,1.27; 15 -6.35,-1.27; 16 -6.35,1.27; 17 -3.81,-1.27; 18 -3.81,1.27; 19 -1.27,-1.27; 20 -1.27,1.27; 21 1.27,-1.27; 22 1.27,1.27; 23 3.81,-1.27; 24 3.81,1.27; 25 6.35,-1.27; 26 6.35,1.27; 27 8.89,-1.27; 28 8.89,1.27; 29 11.43,-1.27; 30 11.43,1.27; 31 13.97,-1.27; 32 13.97,1.27; 33 16.51,-1.27; 34 16.51,1.27; 35 19.05,-1.27; 36 19.05,1.27; 37 21.59,-1.27; 38 21.59,1.27; 39 24.13,-1.27; 40 24.13,1.27
1X03 = drill 1.016 long: 1 -2.54,0; 2 0,0; 3 2.54,0
1X04 = drill 1.016 long: 1 -3.81,0; 2 -1.27,0; 3 1.27,0; 4 3.81,0
JP1 = drill 0.914 long: 1 0,-1.27; 2 0,1.27
LED3MM = drill 0.813 pad 1.676 octagon: A -1.27,0; K 1.27,0
NRF24L01_CHANCAM_ANTEN_ONBOARD = drill 1.016 octagon: 1 1.27,1.27; 2 3.81,1.27; 3 1.27,3.81; 4 3.81,3.81; 5 1.27,6.35; 6 3.81,6.35; 7 1.27,8.89; 8 3.81,8.89
0207/10 = drill 0.813 octagon: 1 -5.08,0; 2 5.08,0
22-23-2041 = drill 1 long: 1 -3.81,0; 2 -1.27,0; 3 1.27,0; 4 3.81,0

### Placement (x,y rotation side)
C1  48.5,44 90 top
C2  104.34,44.03 90 top
C3  130,44 90 top
C10  117.15,148.11 0 top
C40  19.47,156.85 180 top
C42  73.2,148.7 90 top
C43  106.7,115.27 180 top
C44  97.75,153.87 90 top
C45  77,44 90 top
D17  105.44,63.03 0 top
D18  47.52,51.64 180 top
D19  98.87,60.9 270 top
D20  76.36,56.62 180 top
F1  20.55,12.86 0 top
IC3  101.27,142.95 0 bottom
IC4  20.53,116.01 270 top
J1  111.27,154.95 90 top
J2  12.77,29.64 0 top
J3  33.6,150.84 0 top
J19  31,25 90 top
J20  87,25 90 top
J21  59,25 90 top
J27  115,25 90 top
JP1  13,80 270 top
JP2  20,80 270 top
JP3  46.7,116.53 270 top
JP5  123,33 90 bottom
JP6  39,33 90 bottom
JP7  95,33 90 bottom
JP8  67,33 90 bottom
JP14  114,87 0 top
JP16  96.91,101.34 270 top
JP19  114,103 0 top
JP20  114,79 0 top
JP21  114,95 0 top
JP24  62.66,77.95 180 top
JP25  58.16,80.2 180 top
LED2  123.3,98.63 270 top
LED4  22,30 90 top
LED31  119.77,142.45 0 top
M2  105.11,118.26 0 top
R1  47.33,64.48 180 top
R2  33.53,61.19 180 top
R3  123.1,108.14 90 top
R5  22,21 270 top
R87  111.88,144.13 180 top
R88  108.26,85.86 270 top
R91  107.17,100.65 270 top
R92  115.19,73.9 0 top
R93  104.27,90.14 270 top
R94  22.94,143.04 90 top
R95  18.97,143.07 90 top
X15  20.64,130.3 180 top
X17  115,53 90 top
X18  30.51,53.03 90 top
X19  87,53.14 90 top
X20  59,53 90 top

### Tracks (layer width: path | path; a pad name or v marks a point on that pad's centre or on a via)
3V3
  Bottom 0.813: C43.1 108.92,115.12 M2.2 112.32,119.53 114.32,121.53 114.32,131.51 109.5,136.33 101.77,136.33 101.25,136.85 IC3.2 101.25,142.37 102.21,143.33 103.99,143.33 104.79,144.13 R87.2
5V  (via drill 0.8 pad 1.52, 0.8 pad 1.6)
  Top 0.813: v78.64,148.3 78.64,159.13 v78.8,159.29 | v81.34,159.29 81.34,148.35 v81.39,148.3 | v54.09,48.98 54.09,42.01 v54.2,41.89 | v82.73,49.29 82.73,41.91 v82.75,41.89 | v110.37,49.14 110.37,42.01 v110.25,41.89 | v25.98,48.49 v26,42 | v73.28,142.35 64.98,134.05 v44.97,134.05
  Top 1.27: v20,48 v20,42
  Bottom 0.813: 24.39,123.68 IC4.14 | 21.76,151.97 21.92,151.56 21.88,151.67 | 22.01,156.41 C40.+ | R93.2 104.27,84.77 R88.2 110.64,83.16 114,83.16 | JP16.2 101.44,102.57 107,108.13 113.83,108.13 114,107.96 | 91.77,159.06 93.88,156.95 | 93.88,156.95 94.09,156.74 94.09,156.64 | 93.88,156.95 93.88,156.8 95.09,155.59 95.09,153.99 95.4,153.68 | 31.84,159.29 v78.8,159.29 | 29.28,41.89 31,41.89 | 31,41.89 JP6.27 | X20.1 54.3,49.19 v54.09,48.98 | X19.1 82.77,49.33 v82.73,49.29 | X17.1 110.42,49.19 v110.37,49.14 | R1.2 31.74,64.48 R2.2 27.73,61.19 25.12,58.58 25.12,48.66 25.34,48.66 | 25.34,48.66 v25.98,48.49 | v26,42 30.89,42 31,41.89 | 25.34,48.66 29.95,48.66 X18.1 | 114,99.02 110.62,99.02 R91.2 | 118.23,114.58 121.74,114.58 R3.2 | 101.72,41.89 102.12,41.49 C2.1 106.15,41.49 106.55,41.89 | 75.4,41.89 75.83,41.46 C45.1 78.52,41.46 78.94,41.89 | 45.88,41.89 46.31,41.46 C1.1 50.27,41.46 50.7,41.89 | C42.1 73.2,142.44 v73.28,142.35 | v44.97,134.05 42.89,131.97 JP3.1
  Bottom 1.27: J1.P$1 113.3,149.31 | 113.3,149.31 114.39,148.22 | IC3.3 97.75,141.01 C44.+ 95.4,153.68 95.32,153.76 95.32,155.68 92.42,158.58 92.25,158.58 91.77,159.06 81.57,159.06 v81.34,159.29 v78.8,159.29 78.57,159.06 24.22,159.06 C40.+ | 113.3,149.31 113.41,149.31 C10.1 | 21.55,148.12 21.86,148.15 R95.2 | 21.55,148.12 R94.2 26.92,140.82 26.92,132.77 X15.1 24.45,123.74 24.39,123.68 | 22.01,156.41 21.74,156.14 21.76,151.97 21.74,148.13 21.55,148.12 | C42.1 75.34,148.3 v78.64,148.3 v81.39,148.3 J3.P53 J3.P54 | JP2.1 JP2.2 JP2.3 JP2.4 JP2.5 JP2.6 JP2.7 JP2.8 JP2.9 JP2.10 JP2.11 JP2.12 JP2.13 v20,48 | 25,42 v20,42 20.11,41.89 25.11,41.89 | 25,42 v26,42 | 25,42 25.11,41.89 | 25.11,41.89 JP6.27 JP6.28 45.88,41.89 50.7,41.89 v54.2,41.89 JP8.27 JP8.28 75.4,41.89 78.94,41.89 v82.75,41.89 JP7.27 JP7.28 101.72,41.89 106.55,41.89 v110.25,41.89 JP5.27 JP5.28 129.57,41.89 C3.1 133.8,45.26 133.8,68.11 128,73.9 R92.2 116.78,73.9 113.97,76.71 114,76.74 JP20.2
  Bottom 2.54: C44.+ 99.41,152.99 J1.P$1 109.73,152.99 C10.1 111,144.5 111,139.72 118.23,132.49 118.23,114.58 114,110.35 114,107.96 JP19.2 114,99.02 JP21.2 JP14.2 114,83.16 JP20.2
  pour Bottom (no thermals): 126,74 126,89 132,89 132,70 128,74
24V_CS  (via drill 0.8 pad 1.57)
  Bottom 0.813: F1.2B F1.2A v31.8,13.95
  Bottom 1.27: R5.2 27.32,15.92 27.49,15.75
  pour Bottom (no thermals): 25.53,13.02 25.53,15.17 26.92,16.56 124.35,16.56 124.42,16.63 125.32,16.63 126.9,15.05 126.9,12.99 124.51,10.6 27.84,10.6 25.55,12.89
A_ENC1
  Bottom 0.813: IC4.13 22.43,121.09 21.85,121.67 X15.2 21.9,131.19 22.96,132.38 R94.1
A_PID_1
  Bottom 0.813: X17.2 116.86,51.73 119.08,49.51 JP5.33
A_PID_2
  Bottom 0.813: X18.2 33.43,51.76 35.68,49.51 JP6.33
A_PID_3
  Bottom 0.813: X19.2 87.9,51.87 90.26,49.51 JP7.33
A_PID_4
  Bottom 0.813: X20.2 61.48,51.73 63.7,49.51 JP8.33
B_ENC1
  Bottom 0.813: IC4.11 23.07,116.08 23.03,116.17 19.35,120.05 X15.3 18.94,131.51 R95.1
B_PID_1
  Bottom 0.813: JP5.34 126.41,49.51 130.42,53.52 130.42,63.86 129.47,64.81 106.95,64.81 106.92,64.78 106.92,62.79 106.72,62.59 106.72,54.27 X17.3
B_PID_2
  Bottom 0.813: JP6.34 45.12,49.51 45.81,50.2 45.81,62.61 45.65,62.77 32.25,62.77 28.09,58.6 28.09,56.15 28.2,56.04 28.2,55.46 29.36,54.3 X18.3
B_PID_3
  Bottom 0.813: JP7.34 100.51,49.51 102,51 102,59.58 98.49,63.09 98.2,63.09 98.16,63.13 83.54,63.13 81.75,61.34 81.75,57.44 84.78,54.41 X19.3
B_PID_4
  Bottom 0.813: X20.3 52.62,54.27 52.11,54.78 52.11,61.45 53.4,62.74 55.76,62.74 57.89,64.88 71.69,64.88 74.67,61.89 74.67,49.65 74.4,49.37 68.41,49.37 JP8.34
CE  (via drill 0.8 pad 1.57)
  Top 0.813: v93.47,97.27 93.47,87.67 v94.12,87.03
  Bottom 0.813: J3.P93 80.46,97.5 76.68,93.72 76.68,87.56 80.86,83.38 89.72,83.38 93.27,86.93 94.07,86.98 v94.12,87.03 | M2.3 93.78,109.47 93.78,107.27 93.77,107.26 93.78,106.62 93.78,105.97 93.85,105.91 93.85,97.65 v93.47,97.27
CSN
  Bottom 0.813: M2.4 111.47,122.07 112.75,123.35 112.75,130.86 109.21,134.39 98.74,134.39 94.84,130.49 93.08,130.49 91.94,131.63 91.94,154.28 91.02,155.21 43.09,155.21 39.83,151.95 39.83,134.43 38.46,133.06 J3.P16
DIV_PID_1  (via drill 0.8 pad 1.52)
  Top 0.813: v105.25,64.71 105.25,68.49 v105.3,68.54
  Bottom 0.813: J3.P40 38.35,102.58 47.37,93.56 47.37,78.35 52.97,72.75 79.88,72.75 83.03,69.6 102.94,69.6 104,68.54 v105.3,68.54 | JP5.31 121.34,46.58 110.84,46.58 107.5,46.58 105.15,48.94 105.15,63.24 105.25,63.34 v105.25,64.71
DIV_PID_2
  Bottom 0.813: J3.P41 27.76,100.04 23.55,95.82 23.55,47.47 24.65,46.37 31.22,46.37 31.82,46.97 JP6.31
DIV_PID_3  (via drill 0.8 pad 1.52)
  Top 0.813: v77.86,64.6 77.86,70.19 v77.74,70.31
  Bottom 0.813: J3.P42 38.67,100.04 45.8,92.91 45.8,77.7 52.32,71.18 76.87,71.18 v77.74,70.31 | v77.86,64.6 77.83,64.57 77.83,49.08 79.94,46.97 JP7.31
DIV_PID_4  (via drill 0.8 pad 1.57)
  Top 0.813: v30.67,83.23 26.79,83.23 v26.71,83.31
  Bottom 0.813: J3.P43 29.14,97.5 26.98,95.35 26.98,83.58 v26.71,83.31 | JP8.31 51.64,46.97 48.96,49.65 48.96,65.63 31.36,83.23 v30.67,83.23
F0
  Bottom 0.813: J3.P20 37.8,127.98 40.36,125.42 JP3.2
F1
  Bottom 0.813: J3.P22 37.5,125.44 40.06,122.88 JP3.3
F2
  Bottom 0.813: J3.P26 42.87,120.36 JP3.4
F3
  Bottom 0.813: J3.P28 42.87,117.82 JP3.5
F4
  Bottom 0.813: J3.P30 42.87,115.28 JP3.6
F5
  Bottom 0.813: J3.P32 42.87,112.74 JP3.7
F6
  Bottom 0.813: J3.P34 42.87,110.2 JP3.8
F7
  Bottom 0.813: J3.P36 36.16,107.64 JP3.9
GND  (via drill 0.8 pad 1.52, 0.8 pad 1.6)  (4 unrouted)
  Top 0.813: v37.06,163.13 37.06,154.62 v37.13,154.55 | 111.25,110.93 v110.94,110.62 119.57,110.62 v119.75,110.44 | v52.14,150.11 51.94,150.32 v51.94,163.21 | v70.54,150.06 70.54,163.02 v70.58,162.56 | v63.41,52.17 63.41,44.56 v63.28,44.43 | v90.91,52.75 90.97,52.79 90.96,44.26 v90.85,44.36 | v119.34,52.13 119.34,44.66 v119.11,44.43 | v34.97,52.97 34.97,44.59 v34.95,44.56 | v81.7,89.96 71.32,89.96 v71.22,89.86 | v39.61,89.77 49.9,89.77 v49.96,89.82 | v30.08,120.1 30.08,113.28 v29.78,112.98
  Top 1.27: v107,140 v117,140
  Bottom 0.813: J3.P52 J3.P51 73.6,150.84 C42.2 71.73,151.24 v70.54,150.06 | 119.85,148.94 119.85,145.92 121.04,144.73 LED31.K 122.9,139.3 122.9,137 122.9,120.26 | X15.4 16.77,135.17 15.84,136.1 15.84,155.75 C40.- 20.54,160.46 20.54,162 45,162 45,164 94.15,164 94.15,161.09 97.33,157.91 97.33,156.83 C44.- 109.08,156.41 J1.P$2 | J3.P100 J3.P99 84.32,89.96 v81.7,89.96 | JP21.3 120.38,94.44 LED2.K | M2.1 106.38,117.66 C43.2 97.83,109.11 | 97.83,109.11 104.82,109.11 106.33,110.62 v110.94,110.62 | 127.36,115.8 127.36,109.77 | 127.36,109.77 124.18,106.59 119.4,106.59 119.4,107.96 | 127.36,109.77 128.04,109.09 128.04,102.1 | 35.56,150.84 J3.P1 31.74,150.84 30.78,149.88 30.78,146.94 31.96,145.76 J3.P5 | 35.56,150.84 J3.P2 | v37.13,154.55 37.13,152.41 35.56,150.84 | JP16.1 96.91,108.19 97.83,109.11 | J3.P50 J3.P49 33.71,89.77 v39.61,89.77 | v63.41,52.17 63.41,52.98 59.57,56.81 X20.4 | X17.4 116,56.81 118.48,54.33 118.48,53.94 119.34,53.08 v119.34,52.13 | X18.4 32.97,56.84 33.68,56.13 33.68,54.27 v34.97,52.97 | 37.6,44.56 v34.95,44.56 28,44.56 22.44,44.56 | J3.P23 31.36,122.9 | 90.19,53.54 90.19,54.68 87.92,56.95 X19.4 | 90.19,53.54 90.19,53.47 90.22,53.45 | 90.19,53.54 90.91,52.82 v90.91,52.75 | JP19.3 116.58,103.04 118.11,103.04 | JP14.3 116.55,87.01 119.05,87.01 | 118.3,79.11 118.18,79 JP20.3 116.54,80.3 117.88,81.64 | v119.75,110.44 118.52,109.22 118.52,106.05 | 101.23,44.43 102.21,44.43 C2.2 106.48,44.43 106.82,44.43 | 44.95,44.43 46.39,44.43 C1.2 50.61,44.43 51.34,44.43 | JP14.3 116.54,88.16 117.46,89.08 | JP14.3 116.54,86.26 117.56,85.24 | JP21.3 116.54,96.2 117.46,97.12 | JP21.3 116.54,93.83 117.45,92.92
  Bottom 0.813: JP19.3 116.54,104.26 117.7,105.42 | JP19.3 116.54,101.8 117.76,100.58 | JP3.10 42.89,104.49 43.65,103.73
  Bottom 1.27: J1.P$2 111.84,156.95 119.85,148.94 | IC3.1 103.53,140 v107,140 | v117,140 117,139 119,137 122.9,137 | X15.4 16.83,128.21 15.69,127.07 15.01,127.07 | 74.59,44.43 JP8.30 JP8.29 v63.28,44.43 51.34,44.43 44.95,44.43 JP6.30 JP6.29 37.6,44.56 28,44.56 16.44,44.56 16,45 | 74.59,44.43 76.11,44.43 | 76.11,44.43 76.97,44.43 | 76.97,44.43 77.79,44.43 | 77.79,44.43 79.54,44.43 | 79.54,44.43 90.48,44.43 v90.85,44.36 JP7.29 JP7.30 101.23,44.43 106.82,44.43 v119.11,44.43 JP5.29 JP5.30 128.26,44.43 130,46.16 C3.2 | C45.2 77.65,46.32 79.54,44.43 | C45.2 76.48,46.32 74.59,44.43 | C45.2 77.03,44.49 76.97,44.43 | C45.2 77.79,45.56 77.79,44.43 | C45.2 77.03,45.36 76.11,44.43 | 31.36,122.9 30.08,121.62 v30.08,120.1 | v29.78,112.98 29.78,107.32 28.91,106.45 | IC4.7 13.31,104.98 13.01,104.98
  pour Bottom (isolate 1.93, rank 6, no thermals): 0,0 0,170 140,170 140,0
GND_CS
  Bottom 0.813: 21,35 23,37
  Bottom 1.27: LED4.K 22,34 21,35
  pour Bottom (no thermals): 9.85,37.01 12.19,39.35 125.68,39.35 127.23,37.8 127.23,34.59 125.9,33.26 18.94,33.26 16.24,30.56 10.47,30.56 9.83,31.2 9.83,36.85
IRQ
  Bottom 0.813: M2.8 108.92,130.04 107.89,131.07 100.19,131.07 91.25,122.12 91.25,118.81 90.26,117.82 J3.P78
M1_1
  pour Bottom (isolate 0.254, rank 2, no thermals): 112.16,22.79 116.86,18.09 125.6,18.09 125.84,18.33 125.84,23.31 125.09,24.06 113.36,24.06 112.19,22.89
M1_2
  pour Bottom (isolate 0.254, rank 2, no thermals): 28.05,22.8 32.75,18.1 41.49,18.1 41.73,18.34 41.73,23.32 40.98,24.07 29.25,24.07 28.08,22.9
M1_3
  pour Bottom (isolate 0.254, rank 2, no thermals): 83.96,22.71 88.66,18.01 97.4,18.01 97.64,18.25 97.64,23.23 96.89,23.98 85.16,23.98 83.99,22.81
M1_4
  pour Bottom (isolate 0.254, rank 2, no thermals): 56.02,22.91 60.72,18.21 69.46,18.21 69.7,18.45 69.7,23.43 68.95,24.18 57.22,24.18 56.05,23.01
M2_1
  pour Bottom (no thermals): 112.49,27.86 116.2,31.57 120.2,31.57 120.22,31.59 124.78,31.59 125.97,30.4 125.97,27.29 124.85,26.17 113.05,26.17 112.43,26.79 112.43,27.74
M2_2
  pour Bottom (no thermals): 28.32,27.88 32.03,31.59 36.03,31.59 36.05,31.61 40.61,31.61 41.8,30.42 41.8,27.31 40.68,26.19 28.88,26.19 28.26,26.81 28.26,27.76
M2_3
  pour Bottom (no thermals): 84.49,27.75 88.2,31.46 92.2,31.46 92.22,31.48 96.78,31.48 97.97,30.29 97.97,27.18 96.85,26.06 85.05,26.06 84.43,26.68 84.43,27.63
M2_4
  pour Bottom (no thermals): 56.27,27.86 59.98,31.57 63.98,31.57 64,31.59 68.56,31.59 69.75,30.4 69.75,27.29 68.63,26.17 56.83,26.17 56.21,26.79 56.21,27.74
MISO  (via drill 0.8 pad 1.57)
  Top 0.813: v90.28,126.24 90.28,124.5 90.29,124.49 v90.29,115.51
  Bottom 0.813: J3.P75 83.39,120.36 68.01,135.74 68.01,152.02 69.62,153.63 90.37,153.63 90.37,126.33 v90.28,126.24 | M2.7 98.5,127.15 92.82,121.47 92.82,118.15 90.29,115.62 v90.29,115.51
MOSI
  Bottom 0.813: M2.6 109.98,124.61 111.17,125.8 111.17,130.02 108.54,132.65 99.23,132.65 89.67,123.09 89.67,120.17 87.12,120.17 J3.P76
N$1  (via drill 3 pad 6)
  other vias: 6,6
N$2  (via drill 3 pad 6)
  other vias: 6,164
N$3  (via drill 3 pad 6)
  other vias: 134,164
N$5
  Bottom 0.813: LED2.A 123.3,102.86 R3.1
N$6  (via drill 3 pad 6)
  other vias: 134,6
N$7
  Bottom 1.27: LED4.A R5.1
N$124
  Bottom 0.813: J2.+ 13.01,14.72 10.76,12.47 10.39,12.84 F1.1A F1.1B
  pour Bottom (no thermals): 9.92,24.94 9.92,12.18 10.74,11.36 16.03,11.36 18.05,13.38 18.05,24.05 14.83,27.27 12.15,27.27 9.97,25.09
N$127
  Bottom 0.813: R87.1 117.06,143.89 LED31.A
PWM_PID_1
  Bottom 0.813: J3.P44 38.98,97.5 44.22,92.26 44.22,77.05 51.67,69.6 74.94,69.6 76.51,68.03 102.28,68.03 103.93,66.38 130.12,66.38 131.99,64.51 131.99,52.87 126.09,46.97 JP5.32
PWM_PID_2
  Bottom 0.813: J3.P45 30.44,94.96 30.36,95.03 28.56,93.23 28.56,82.94 30.07,81.43 30.93,81.43 47.38,64.98 47.38,49.54 44.85,47.02 40.32,47.02 JP6.32
PWM_PID_3
  Bottom 0.813: J3.P46 39.29,94.96 42.65,91.6 42.65,76.39 51.01,68.03 74.28,68.03 75.86,66.45 101.63,66.45 103.57,64.51 103.57,48.94 101.61,46.97 JP7.32
PWM_PID_4
  Bottom 0.813: J3.P47 31.77,92.42 30.13,90.79 30.13,86.68 50.36,66.45 73.63,66.45 76.25,63.84 76.25,62.22 76.25,48.99 74.23,46.97 JP8.32
RX3  (via drill 0.8 pad 1.57)
  Top 0.813: v90.25,97.46 90.25,80.89 v89.46,80.1
  Bottom 0.813: v89.46,80.1 89.33,80.23 88.32,79.22 JP24.1 | J3.P84 89.26,110.2 90.25,109.21 v90.25,97.46
RX_LABAN  (via drill 0.8 pad 1.57)
  Top 0.813: v99.56,95.7 v99.56,87.57
  Bottom 0.813: JP16.3 98.2,100.03 98.81,100.03 99.56,99.28 v99.56,95.7 | J3.P91 80.77,100.04 75.11,94.38 75.11,86.91 80.21,81.81 90.37,81.81 93.28,84.72 96.71,84.72 v99.56,87.57
RX_PID  (via drill 0.8 pad 1.52)
  Top 0.813: v108.4,59.48 100.91,59.48 v100.32,58.88 | v83.42,60.51 73.06,60.51 v72.92,60.38 | v58.76,76 58.58,75.83 v58.58,63.2 | v44.13,56.25 53.74,56.25 v53.78,56.29
  Bottom 0.813: JP6.37 36.4,54.59 35.26,55.74 35.3,55.78 35.3,58.95 37.55,61.19 R2.1 41.1,61.19 44.13,58.16 v44.13,56.25 | JP8.37 64.65,54.59 63.29,55.96 63.29,59.4 64.27,60.38 | JP5.37 121,54.59 118.47,57.12 118.47,58.93 117.92,59.48 v108.4,59.48 | 100.2,59.01 v100.32,58.88 99.29,59.92 91.58,59.92 | 91.58,59.92 90.98,60.51 v83.42,60.51 | v72.92,60.38 64.27,60.38 | v58.58,63.2 58.58,61.8 | v58.76,76 58.16,76.6 JP25.2 | v53.78,56.29 53.78,57.01 57.15,60.38 | 57.15,60.38 58.58,61.8 | 57.15,60.38 60.01,60.38 | 60.01,60.38 64.27,60.38 | 58.58,61.8 60.01,60.38 | JP7.37 92.52,54.59 90.86,56.26 90.86,59.2 91.58,59.92
SCK  (via drill 0.8 pad 1.57, 0.8 pad 1.6)
  Top 0.813: v94.54,118.71 94.61,118.78 94.49,118.9 v94.49,132.55
  Bottom 0.813: M2.5 99.26,124.61 94.54,119.89 v94.54,118.71 | 88.41,156.78 | 88.41,156.78 91.67,156.78 93.52,154.94 93.52,133.52 v94.49,132.55 | 88.41,156.78 33.91,156.78 28.99,151.86 28.99,135.18 31.11,133.06 J3.P15
SV1
  Bottom 0.813: J3.P97 79.83,92.42 79.83,88.87 82.17,86.53 88.42,86.53 92.73,90.84 106.5,90.84 108.12,89.22 | R88.1 108.26,89.37 108.12,89.22 | 108.12,89.22 110.81,86.53 JP14.1
SV2
  Bottom 0.813: J3.P98 97.52,92.42 | 97.52,92.42 97.56,92.46 | 104.23,92.42 97.52,92.42 | R93.1 104.23,95.18 104.23,92.42 | 104.23,92.42 105.16,92.42 106.31,93.57 108.94,93.57 108.98,93.53 110.46,93.53 JP21.1
SV3
  Bottom 0.813: J3.P95 80.14,94.96 78.25,93.07 78.25,88.22 81.52,84.95 89.07,84.95 93.38,89.27 101.57,89.27 101.97,88.86 101.97,83.3 106.27,79 JP20.1 111.46,74.87 110.49,73.9 R92.1
SV4
  Bottom 0.813: JP19.1 108.49,101.74 107.78,101.03 | 107.78,101.03 100.75,94 98.25,94 98.21,94.03 96.91,94.03 96.87,94 88.83,94 87.86,94.96 J3.P96 | R91.1 107.17,101.64 107.78,101.03
TX3
  Bottom 0.813: JP25.1 62.53,83.8 68.71,83.8 73.53,88.61 73.53,95.03 79.79,101.29 79.79,105.6 81.85,107.66 J3.P85
TX_LABAN
  Bottom 0.813: J3.P94 87.7,97.5 89.63,95.57 95.66,95.57 96.91,96.82 JP16.4
TX_PID  (via drill 0.8 pad 1.52)
  Top 0.813: v81.29,64.71 81.36,64.78 v81.36,73.88 | v54.94,75 v54.94,64.6
  Bottom 0.813: D17.A 99.95,64.71 D19.A 82.89,64.71 81.04,62.86 | 81.04,62.86 80.17,61.99 D20.A | 61.7,74.33 62.66,75.28 JP24.2 62.66,74.62 62.95,74.33 | 81.04,62.86 81.04,64.47 v81.29,64.71 | v81.36,73.88 80.98,73.88 80.53,74.33 62.95,74.33 | 62.95,74.33 61.7,74.33 | v54.94,75 55.62,74.33 61.7,74.33 | D18.A 50.53,52.44 50.53,63.73 | 50.53,63.73 50.53,64.08 51.32,64.88 52.36,64.88 | R1.1 52.36,64.88 | 52.36,64.88 54.66,64.88 v54.94,64.6 54.82,64.48 R1.1 | R1.1 51.28,64.48 50.53,63.73
TX_PID1
  Bottom 0.813: D17.C 109.46,63.23 128.77,63.23 128.84,63.16 128.84,56.44 127,54.59 JP5.38
TX_PID2
  Bottom 0.813: JP6.38 40.77,54.59 D18.C
TX_PID3
  Bottom 0.813: JP7.38 97.99,54.59 98.94,55.55 98.87,55.62 D19.C
TX_PID4
  Bottom 0.813: JP8.38 70.52,54.59 D20.C
|A_ENC1
  Bottom 0.813: IC4.12 26.72,118.55 27.71,117.56 33.34,117.56 J3.P27
|B_ENC1
  Bottom 0.813: IC4.10 26.23,113.47 28.06,115.3 33.58,115.3 J3.P29

### Text on the board
tPlace: 5V SUPPLY | _ | + | 0 B A 5 | NRF24 | RELAY | S 5V GND | DESIGNED BY TNM | TX RX 5V 0V | S 5V GND | S 5V GND | S 5V GND | GND | 5v | 5 A B 0 | 5 A B 0 | 5 A B 0 | 5 A B 0 | _ | +